# EAGLE design Heatbed-MK24 (EAGLE 6.5.0)
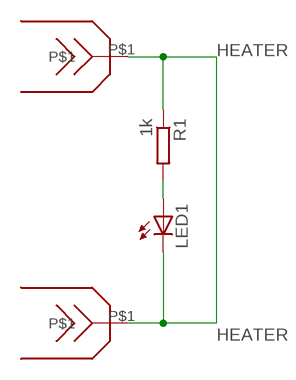
[diagram p0: schematic, sheet 1]

## Parts
LED1  LEDCHIPLED_0805  [CHIPLED_0805]
R1  1k  R-EU_M0805  [M0805]
U$1  FASTONSMD  [FASTONSMD]
U$2  FASTONSMD  [FASTONSMD]

## Nets
HEATER: LED1.C R1.1 U$1.P$1 U$2.P$1
N$1: LED1.A R1.2

## Library data of the parts
LED1 = led:LED: LED OSRAM: - CHIPLED LG R971, LG N971, LY N971, LG Q971, LY Q971, LO R971, LY R971 LH N974, LH R974 LS Q976, LO Q976, LY Q976 LO Q996 - Hyper CHIPLED LW Q18S LB Q993, LB Q99A, LB R99A - SideLED LS A670, LO A670, LY A670, LG A670, LP A670 LB A673, LV A673, LT A673, LW A673 LH A674 LY A675 LS A676, LA A676, LO A676, LY A676, LW A676 LS A679, LY A679, LG A679 - Hyper Micro SIDELED® LS Y876, LA Y876, LO Y876, LY Y876 LT Y87S - SmartLED LW L88C, LW L88S LB L89C, LB L89S, LG L890 LS L89K, LO L89K, LY L89K LS L896, LA L896, LO L896, LY L896 - TOPLED LS T670, LO T670, LY T670, LG T670, LP T670 LSG T670, LSP T670, LSY T670, LOP T670, LYG T670 LG T671, LOG T671, LSG T671 LB T673, LV T673, LT T673, LW T673 LH T674 LS T676, LA T676, LO T676, LY T676, LB T676, LH T676, LSB T676, LW T676 LB T67C, LV T67C, LT T67C, LS T67K, LO T67K, LY T67K, LW E67C LS E67B, LA E67B, LO E67B, LY E67B, LB E67C, LV E67C, LT E67C LW T67C LS T679, LY T679, LG T679 LS T770, LO T770, LY T770, LG T770, LP T770 LB T773, LV T773, LT T773, LW T773 LH T774 LS E675, LA E675, LY E675, LS T675 LS T776, LA T776, LO T776, LY T776, LB T776 LHGB T686 LT T68C, LB T68C - Hyper Mini TOPLED® LB M676 - Mini TOPLED Santana® LG M470 LS M47K, LO M47K, LY M47K Source: http://www.osram.convergy.de LUXEON: - LUMILED® LXK2-PW12-R00, LXK2-PW12-S00, LXK2-PW14-U00, LXK2-PW14-V00 LXK2-PM12-R00, LXK2-PM12-S00, LXK2-PM14-U00 LXK2-PE12-Q00, LXK2-PE12-R00, LXK2-PE12-S00, LXK2-PE14-T00, LXK2-PE14-U00 LXK2-PB12-K00, LXK2-PB12-L00, LXK2-PB12-M00, LXK2-PB14-N00, LXK2-PB14-P00, LXK2-PB14-Q00 LXK2-PR12-L00, LXK2-PR12-M00, LXK2-PR14-Q00, LXK2-PR14-R00 LXK2-PD12-Q00, LXK2-PD12-R00, LXK2-PD12-S00 LXK2-PH12-R00, LXK2-PH12-S00 LXK2-PL12-P00, LXK2-PL12-Q00, LXK2-PL12-R00 Source: www.luxeon.com KINGBRIGHT: KA-3528ASYC Source: www.kingbright.com
R1 = rcl:R-EU_: RESISTOR, European symbol
U$1 U$2 = heatbed:FASTONSMD

## Board
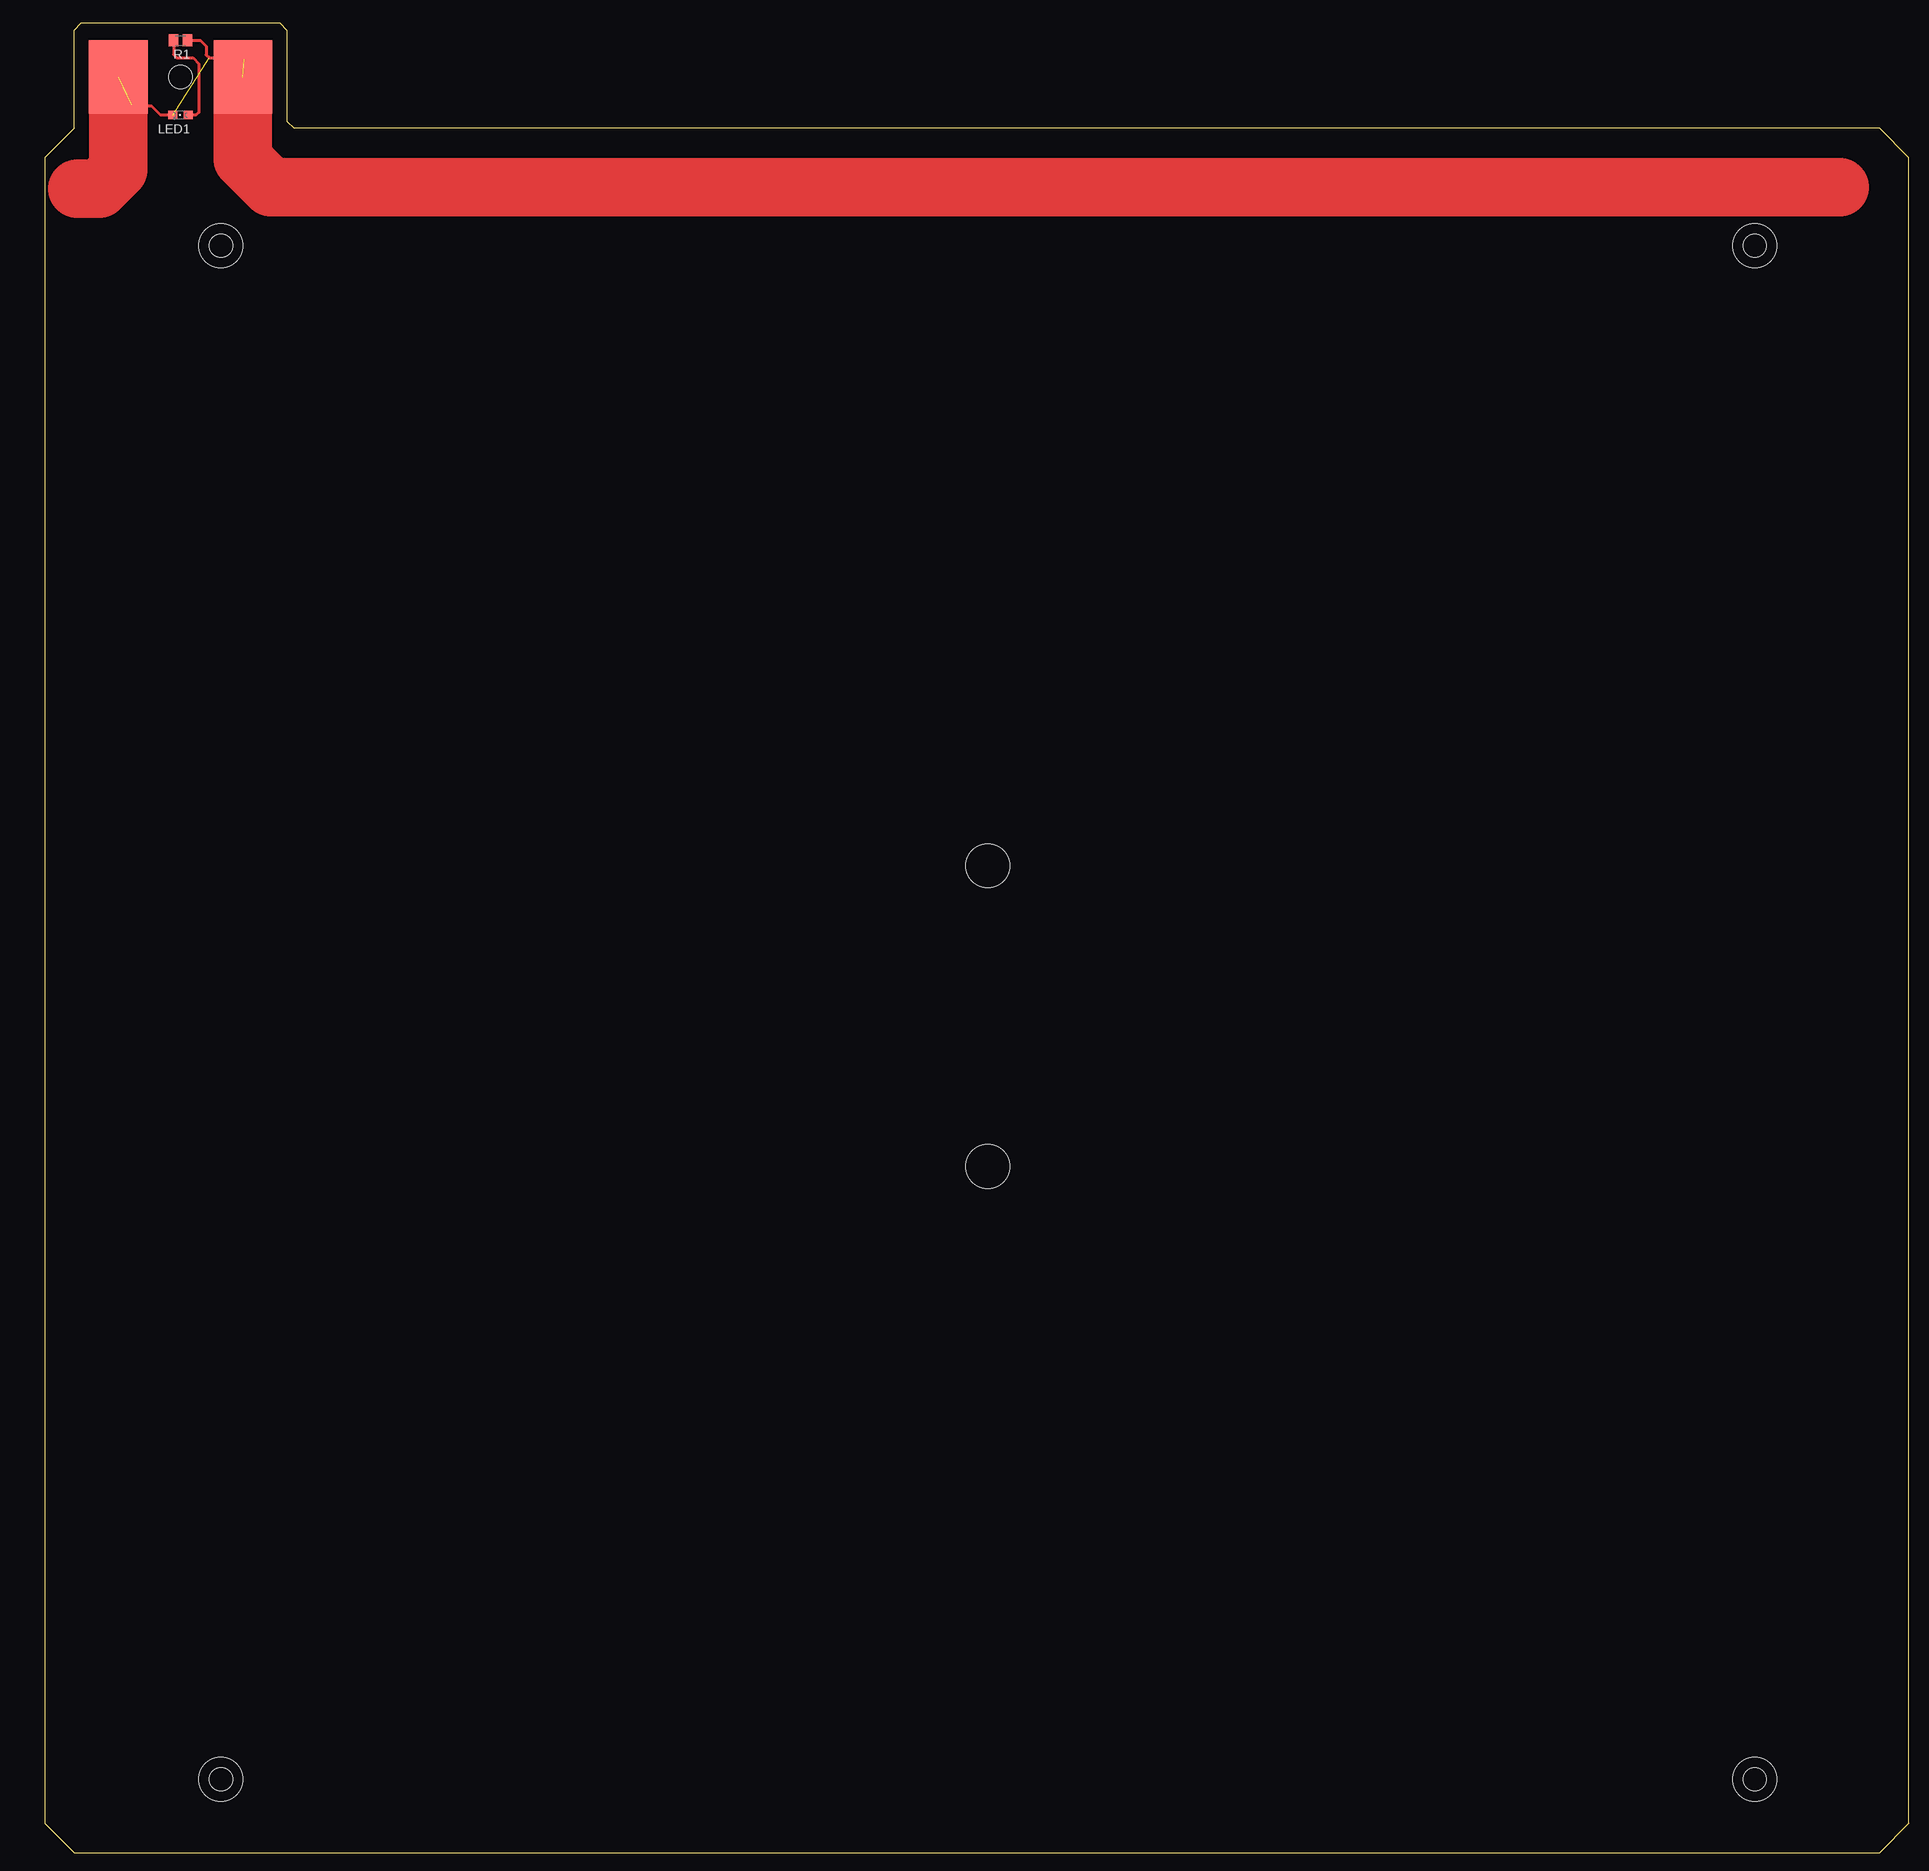
[diagram p1: board, top side]
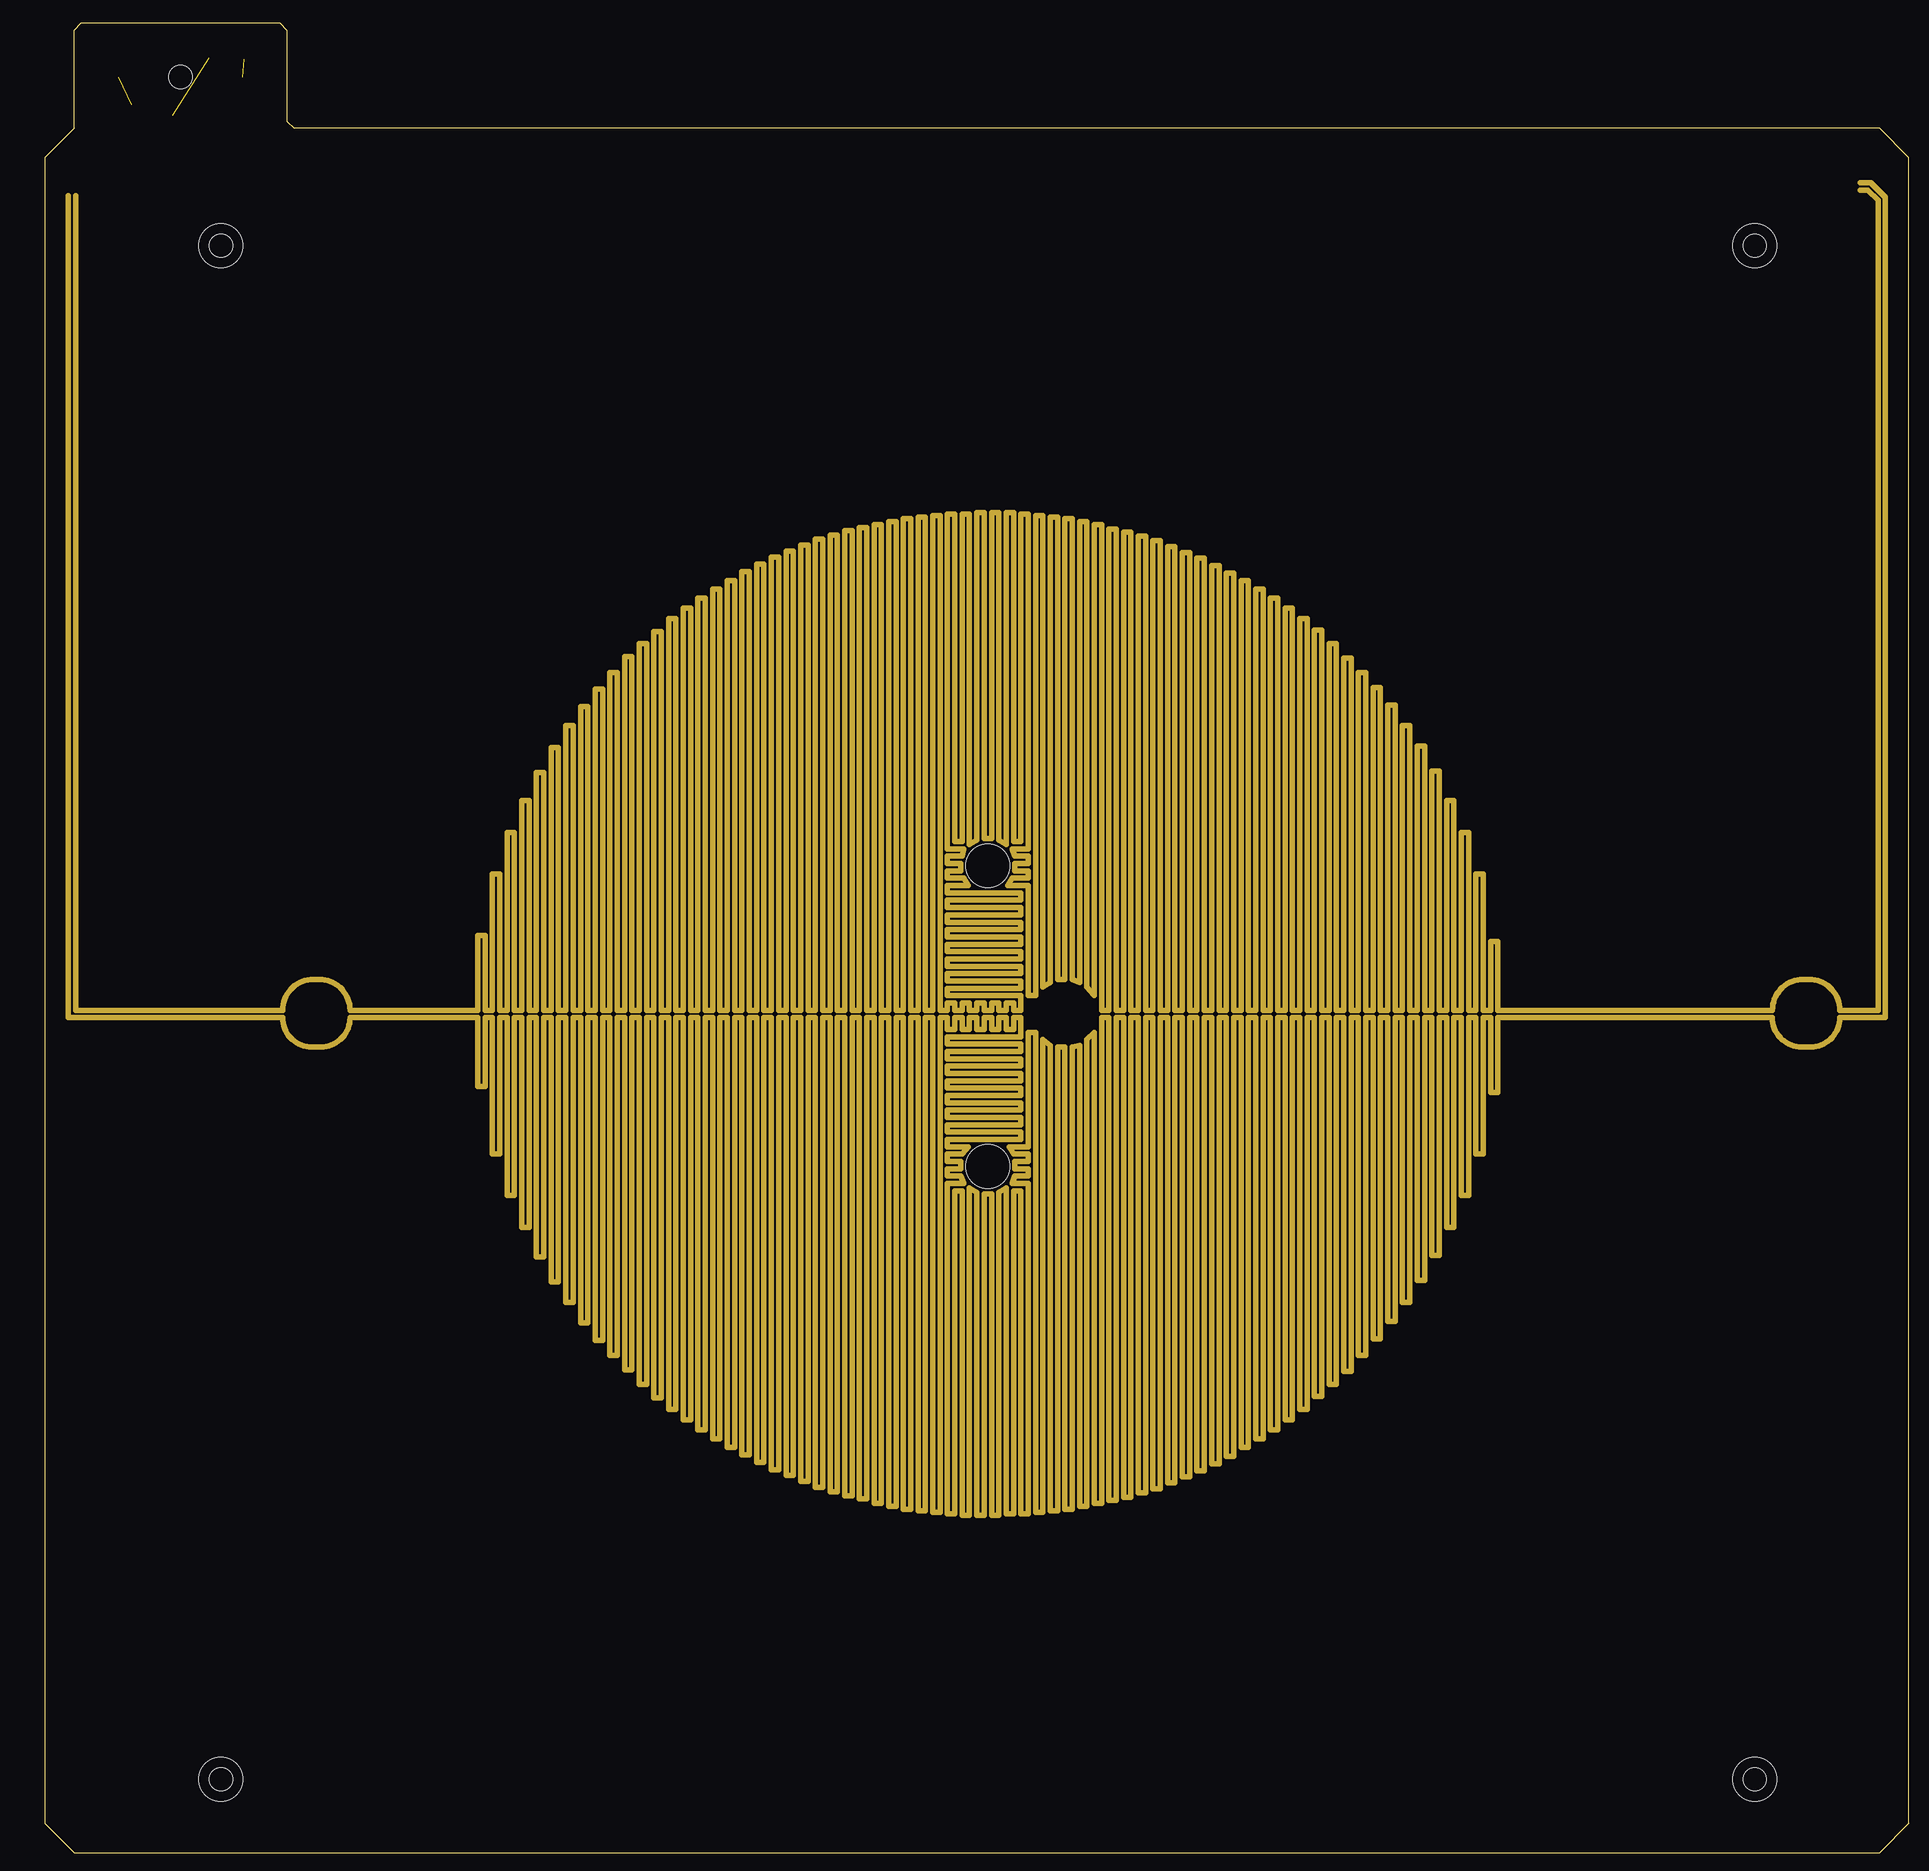
[diagram p2: board, inner layer Top-LowHeat]
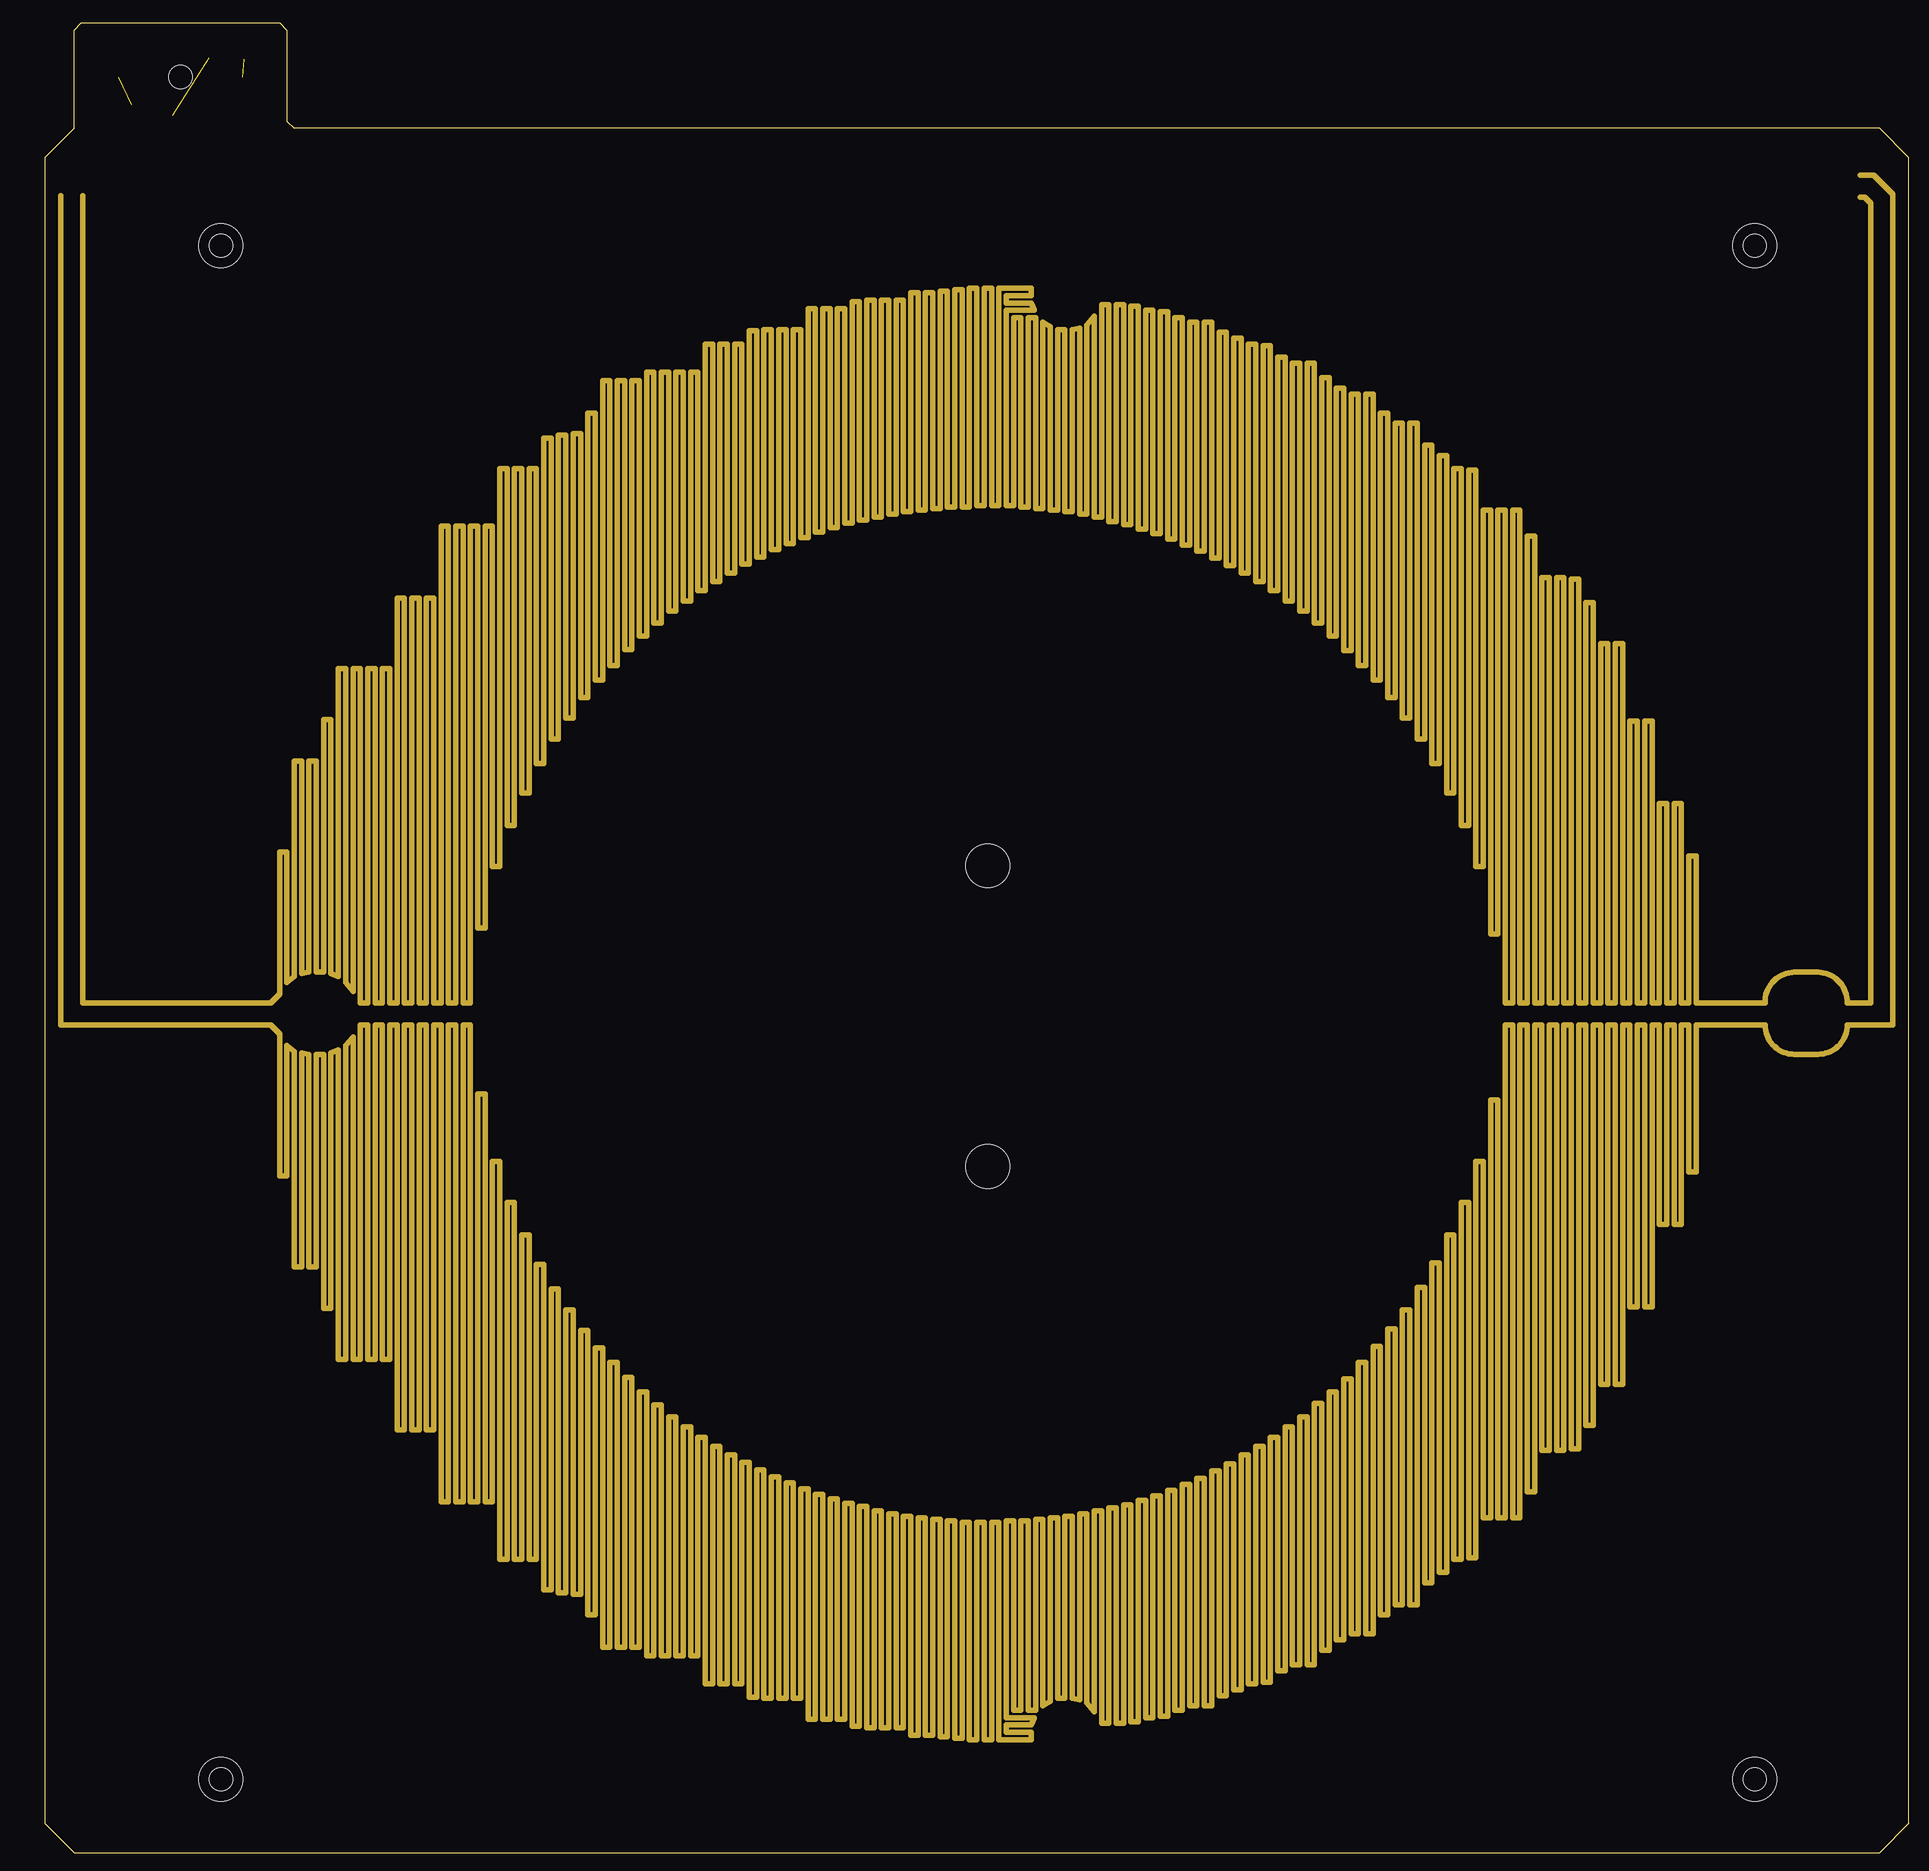
[diagram p3: board, inner layer Top-MedHeat]
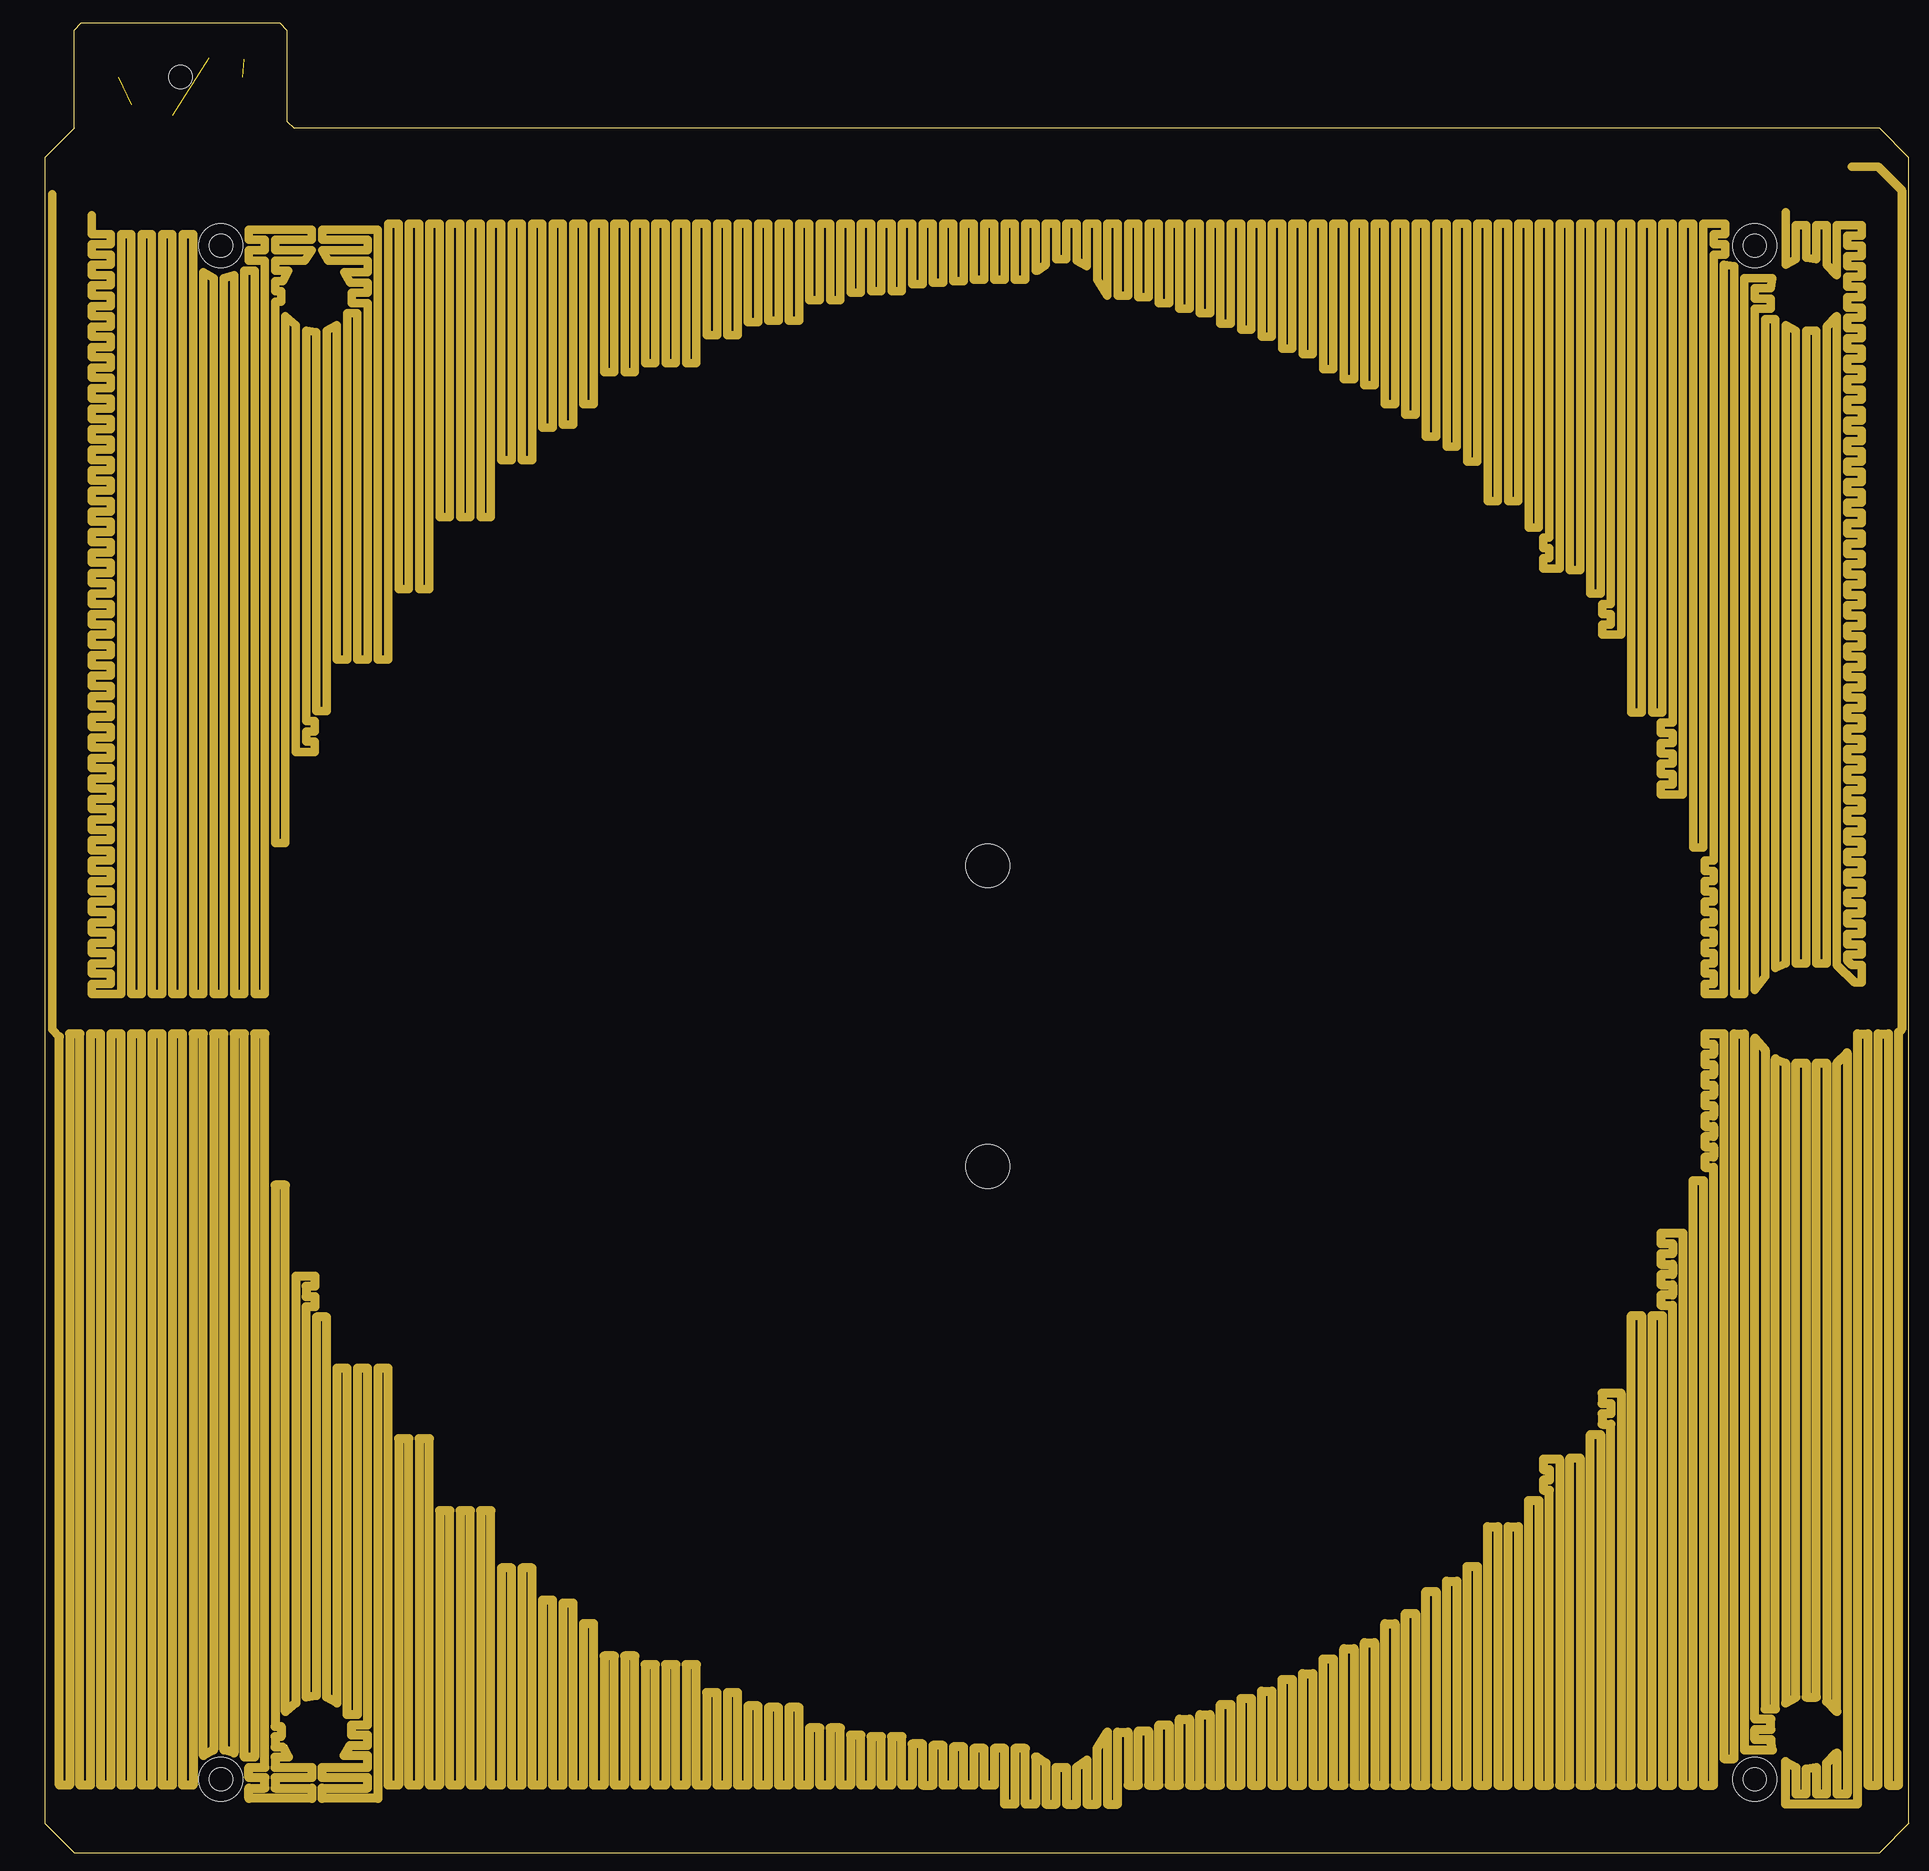
[diagram p4: board, inner layer Top-HighHeat]
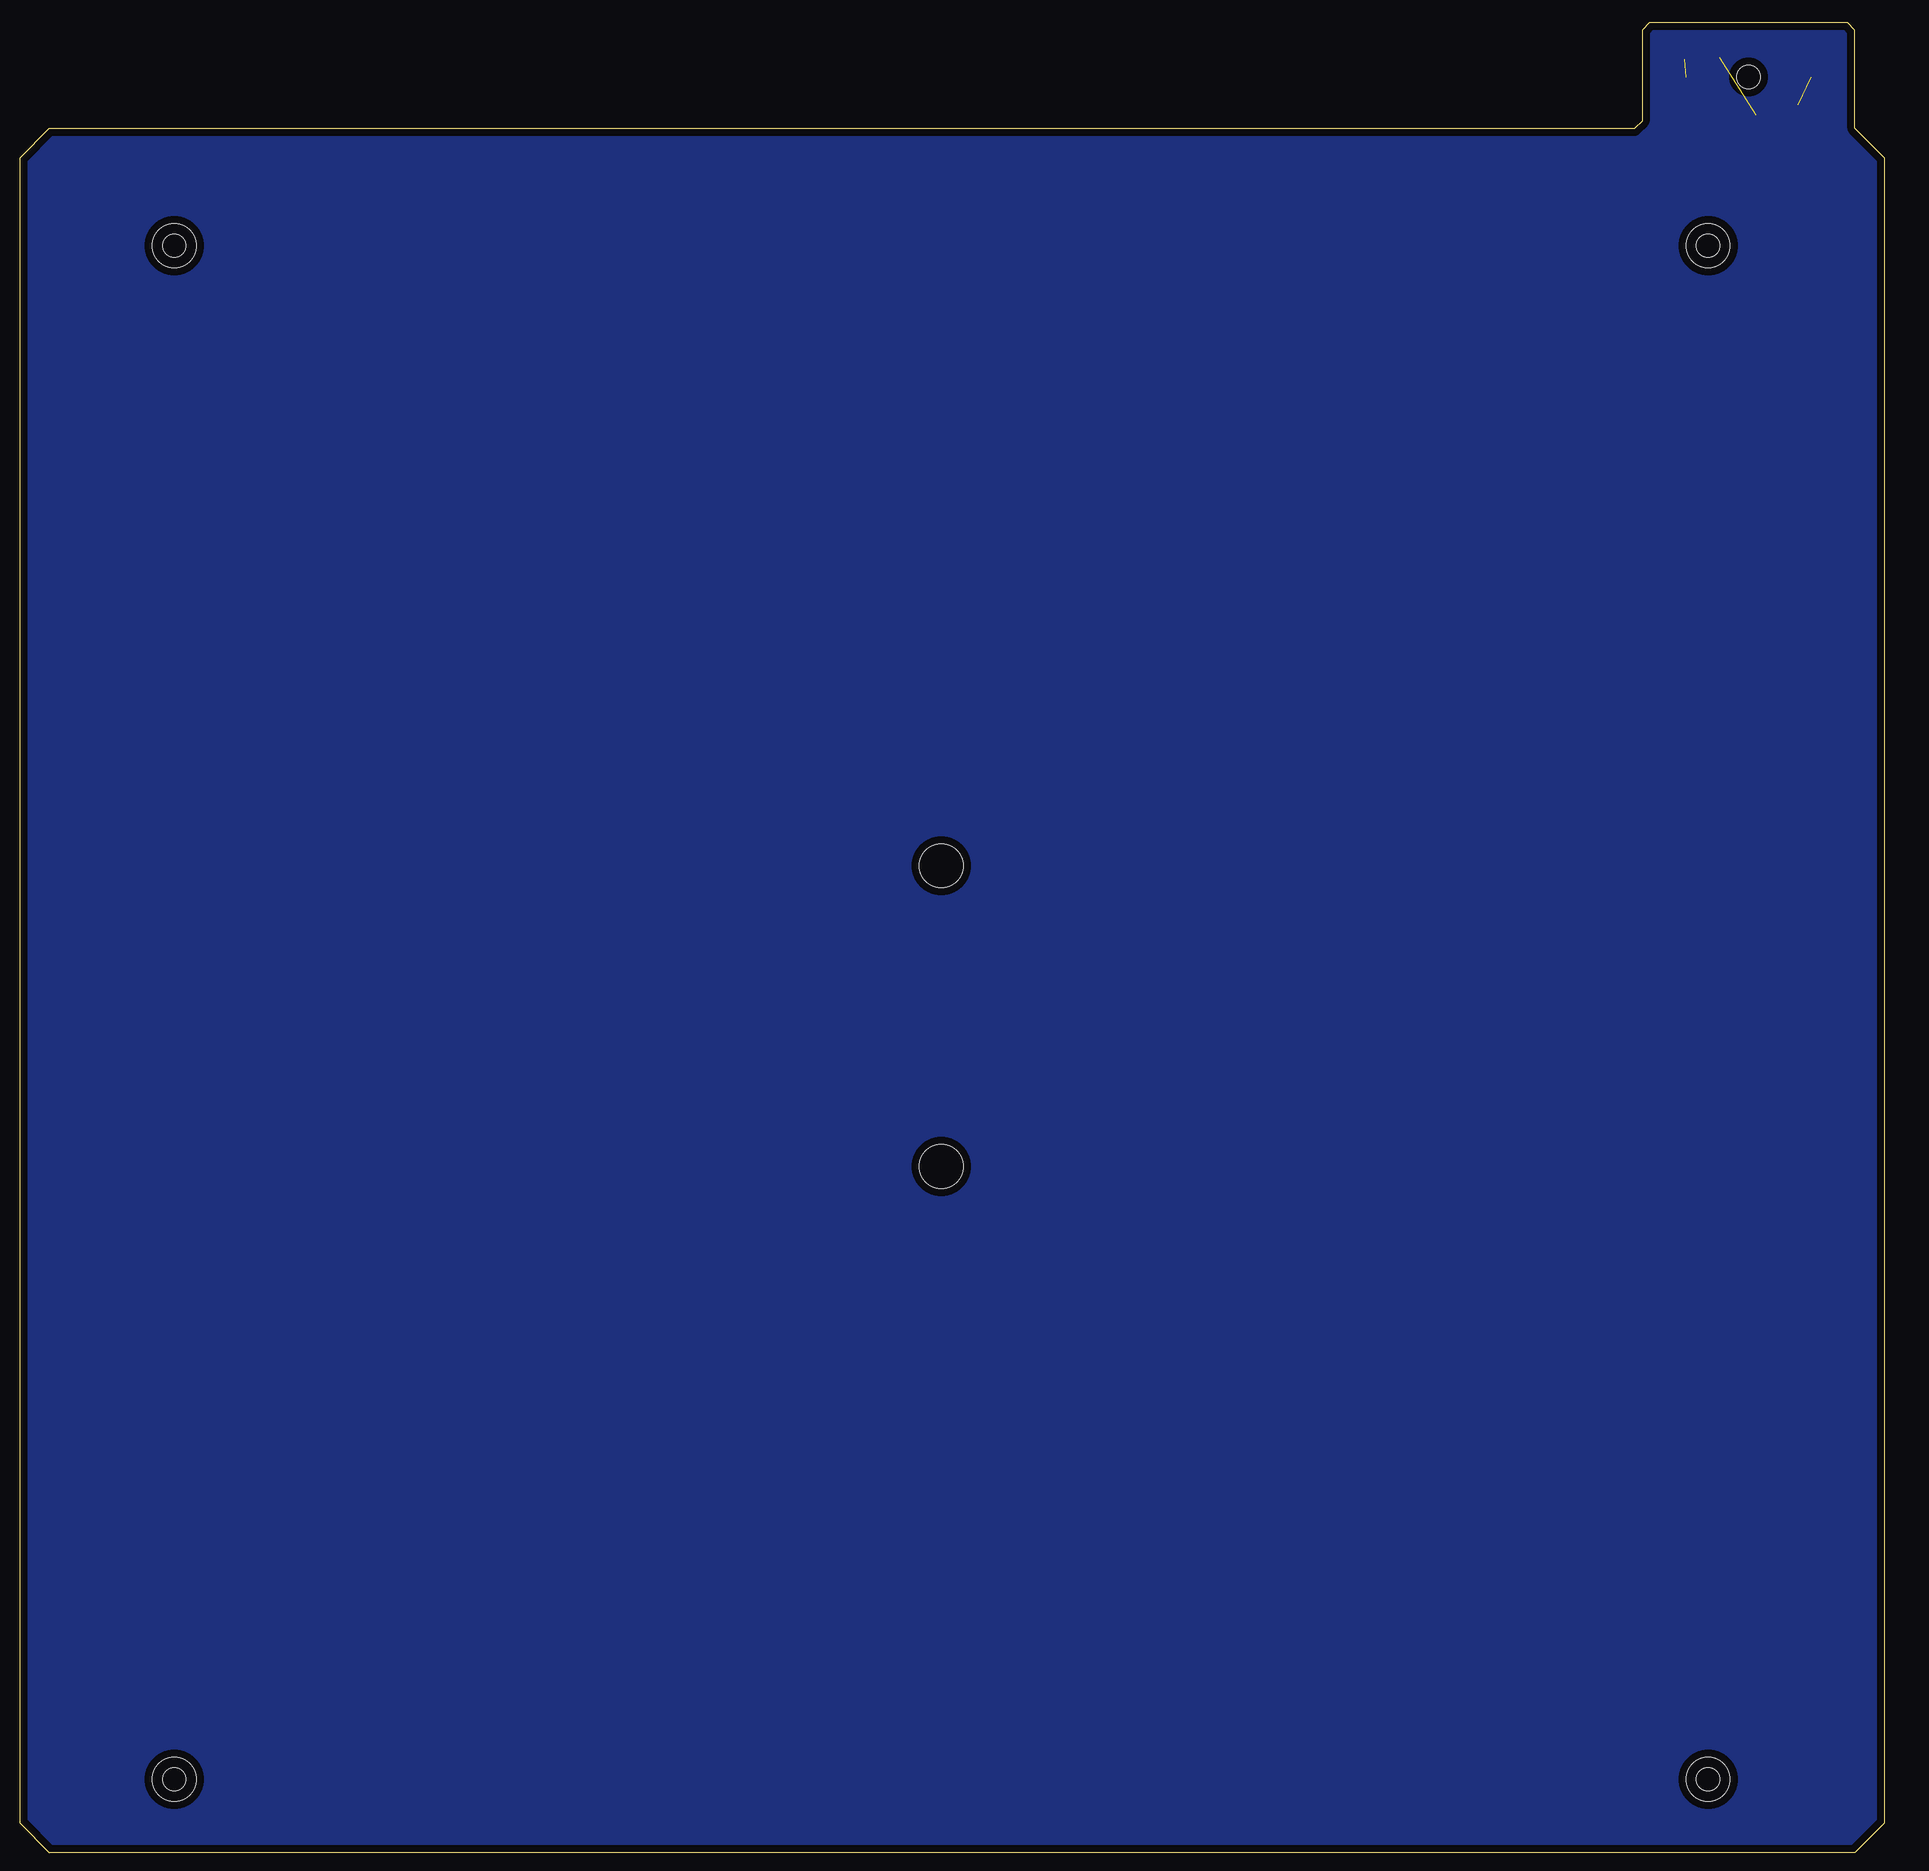
[diagram p5: board, bottom side, seen from below]

Size 254 x 249.4 mm. Coordinates in mm from the lower left corner, seen from the top.
Outline: 250,235 34,235 33,236 33,248.4 32,249.4 5,249.4 4,248.4 4,235 0,231 0,4 4,0 250,0 254,4 254,231 250,235
Copper layers (1+2+3+4+5*16): Top-Supply 0.045mm / dielectric 0.01mm / Top-LowHeat 0.045mm / dielectric 0.01mm / Top-MedHeat 0.045mm / dielectric 0.01mm / Top-HighHeat 0.045mm / dielectric 2.8mm / Leveling 0.045mm / dielectric 0.2mm / Bottom 0.045mm
Design rules "default *": minimum track width 10mil, minimum drill 24mil, track to track 0.15mm, track to pad 0.15mm, pad to pad 0.15mm, via to via 0.15mm, smd to smd 0.15mm, copper to edge 40mil, drill to drill 8mil, minimum pad ring 10mil, minimum via ring 8mil, stop-mask expansion 4mil, vias tented up to drill 0mil, thermal gap 10mil
Holes 3.2 mm at 18.5,242 24,10 233,10 233,219 24,219
Holes 6 mm at 24,10 233,10 233,219 24,219 128.5,93.5 128.5,134.5
tKeepout: area -0.2,112 to 255.8,116.6; area -0.2,112 to 1.8,237; area 252.2,111.4 to 255.6,238.4; area 0.2,5.6 to 252.4,9.4; area 0,219.4 to 252.2,223.2

### Footprints (pad centres in the part's own frame; a part is rotated, then mirrored left to right if it is on the bottom)
CHIPLED_0805 = smd 1.2 x 1.2: A 0,-1.05; C 0,1.05
M0805 = smd 1.3 x 1.6: 1 -0.95,0; 2 0.95,0
FASTONSMD = smd 8 x 10: P$1 0,0

### Placement (x,y rotation side)
LED1  18.5,236.82 90 top
R1  18.5,247 180 top
U$1  10,242 180 top
U$2  27,242 180 top

### Tracks (layer width: path | path; a pad name or v marks a point on that pad's centre or on a via)
HEAT-HIGH-BOT
  Top-HighHeat 1.24: 2,111.2 2,9.2 3.4,9.2 3.4,111.6 4.8,111.6 4.8,9.2 6.2,9.2 6.2,111.6 7.6,111.6 7.6,9.2 9,9.2 9,111.6 10.4,111.6 10.4,9.2 11.8,9.2 11.8,111.6 13.2,111.6 13.2,9.2 14.6,9.2 14.6,111.6 16,111.6 16,9.2 17.4,9.2 17.4,111.6 18.8,111.6 18.8,9.2 20.2,9.2 20.2,111.6 21.6,111.6 21.6,13.2 23,14 23,111.6 24.4,111.6 24.4,14 25.8,13.6 25.8,111.6 27.2,111.6 27.2,13 28.6,13 28.6,111.6 30,111.6 30,11.6 27.8,11.6 27.8,10.2 30,10.2 30,8.8 27.8,8.8 27.8,7.4 36.4,7.4 36.4,8.8 31.4,8.8 31.4,10.2 36.4,10.2 36.4,11.6 31.4,11.6 31.4,13 33.2,13 32.4,14.4 31.4,14.4 31.4,15.8 32.2,15.8 32.2,17.2 31.4,17.2 31.4,91 32.8,91 32.8,19.2 34.2,20.4 34.2,78.6 36.8,78.6 36.8,77.2 35.6,77.2 35.6,75.8 36.8,75.8 36.8,74.4 35.6,74.4 35.6,21.2 37,21.4 37,73 38.4,73 38.4,21.2 39.8,20.4 39.8,66 41.2,66 41.2,18.8 42.6,18.8 42.6,66 44,66 44,17.4 41.8,17.4 41.8,16 44,16 44,14.6 41.6,14.6 40.8,13.2 44,13.2 44,11.6 37.8,11.6 37.8,10.2 44,10.2 44,8.8 37.8,8.8 37.8,7.4 45.4,7.4 45.4,66 46.8,66 46.8,9.2 48.2,9.2 48.2,56.4 49.6,56.4 49.6,9.2 51,9.2 51,56.4 52.4,56.4 52.4,9.2 53.8,9.2 53.8,46.6 55.2,46.6 55.2,9.2 56.6,9.2 56.6,46.6 58,46.6 58,9.2 59.4,9.2 59.4,46.6 60.8,46.6 60.8,9.2 62.2,9.2 62.2,38.8 63.6,38.8 63.6,9.2 65,9.2 65,38.8 66.4,38.8 66.4,9.2 67.8,9.2 67.8,34.4 69.2,34.4 69.2,9.2 70.6,9.2 70.6,34 72,34 72,9.2 73.4,9.2 73.4,31.2 74.8,31.2 74.8,9.2 76.2,9.2 76.2,26.8 77.6,26.8 77.6,9.2 79,9.2 79,26.8 80.4,26.8 80.4,9.2 81.8,9.2 81.8,25.6 83.2,25.6 83.2,9.2 84.6,9.2 84.6,25.6 86,25.6 86,9.2 87.4,9.2 87.4,25.6 88.8,25.6 88.8,9.2 90.2,9.2 90.2,21.8 91.6,21.8 91.6,9.2 93,9.2 93,21.8 94.4,21.8 94.4,9.2 95.8,9.2 95.8,20 97.2,20 97.2,9.2 98.6,9.2 98.6,19.8 100,19.8 100,9.2 101.4,9.2 101.4,19.8 102.8,19.8 102.8,9.2 104.2,9.2 104.2,17 105.6,17 105.6,9.2 107,9.2 107,17 108.4,17 108.4,9.2 109.8,9.2 109.8,16 111.2,16 111.2,9.2 112.6,9.2 112.6,15.8 114,15.8 114,9.2 115.4,9.2 115.4,15.8 116.8,15.8 116.8,9.2 118.2,9.2 118.2,14.8 119.6,14.8 119.6,9.2 121,9.2 121,14.6 122.4,14.6 122.4,9.2 123.8,9.2 123.8,14.4 125.2,14.4 125.2,9.2 126.6,9.2 126.6,14.2 128,14.2 128,9.2 129.4,9.2 129.4,14.2 130.8,14.2 130.8,6.6 132.2,6.6 132.2,14.2 133.6,14.2 133.6,6.6 135,6.6 135,13 135.2,13 136.4,12.2 136.4,6.6 137.8,6.6 137.8,11.6 139.2,11.6 139.2,6.6 140.6,6.6 140.6,11.6 142,12.6 142,6.6 143.4,6.6 143.4,14.2 144.8,16.4 144.8,6.6 146.2,6.6 146.2,16.4 147.6,16.4 147.6,9.2 149,9.2 149,16.6 150.4,16.6 150.4,9.2 151.8,9.2 151.8,17.4 153.2,17.4 153.2,9.2 154.6,9.2 154.6,18.2 156,18.2 156,9.2 157.4,9.2 157.4,18.8 158.8,18.8 158.8,9.2 160.2,9.2 160.2,20.2 161.6,20.2 161.6,9.2 163,9.2 163,21 164.4,21 164.4,9.2 165.8,9.2 165.8,22 167.2,22 167.2,9.2 168.6,9.2 168.6,23.6 170,23.6 170,9.2 171.4,9.2 171.4,24.4 172.8,24.4 172.8,9.2 174.2,9.2 174.2,26.4 175.6,26.4 175.6,9.2 177,9.2 177,27.8 178.4,27.8 178.4,9.2 179.8,9.2 179.8,28.6 181.2,28.6 181.2,9.2 182.6,9.2 182.6,31.2 184,31.2 184,9.2 185.4,9.2 185.4,32.6 186.8,32.6 186.8,9.2 188.2,9.2 188.2,35.6 189.6,35.6 189.6,9.2 191,9.2 191,37 192.4,37 192.4,9.2 193.8,9.2 193.8,39 195.2,39 195.2,9.2 196.6,9.2 196.6,44.4 198,44.4 198,9.2 199.4,9.2 199.4,44.4 200.8,44.4 200.8,9.2 202.2,9.2 202.2,48 203.6,48 203.6,9.2 205,9.2 205,49.4 204.2,49.4 204.2,50.8 205,50.8 205,52.2 204.2,52.2 204.2,53.6 206.4,53.6 206.4,9.2 207.8,9.2 207.8,53.8 209.2,53.8 209.2,9.2 210.6,9.2 210.6,57 212,57 212,9.2 213.4,9.2 213.4,58.4 212.2,58.4 212.2,59.8 213.4,59.8 213.4,61.2 212.2,61.2 212.2,62.6 214.8,62.6 214.8,9.2 216.2,9.2 216.2,73.2 217.6,73.2 217.6,9.2 219,9.2 219,73.2 220.4,73.2 220.4,9.2 221.8,9.2 221.8,74.6 220.2,74.6 220.2,76 221.8,76 221.8,77.4 220.2,77.4 220.2,78.8 221.8,78.8 221.8,80.2 220.2,80.2 220.2,81.6 221.8,81.6 221.8,83 220.2,83 220.2,84.4 223.2,84.4 223.2,9.2 224.6,9.2 224.6,91.6 226,91.6 226,9.2 227.4,9.2 227.4,93.4 226.2,93.4 226.2,94.8 227.4,94.8 227.4,96.2 226.2,96.2 226.2,97.6 227.4,97.6 227.4,99 226.2,99 226.2,100.4 227.4,100.4 227.4,101.8 226.2,101.8 226.2,103.2 227.4,103.2 227.4,104.6 226.2,104.6 226.2,106 227.4,106 227.4,107.4 226.2,107.4 226.2,108.8 227.4,108.8 227.4,110.2 226.2,110.2 226.2,111.6 228.8,111.6 228.8,12.8 230.2,12.8 230.2,111.6 231.6,111.6 231.6,14 235.4,14 235.2,15.4 233,15.4 233,16.8 235.2,16.8 235.2,18.2 233,18.2 233,111 234.4,109.4 234.4,19.6 235.8,19.6 235.8,108.2 237.2,107.6 237.2,20.4 238.6,21.2 238.6,107.6 240,107.6 240,21.2 241.4,21.2 241.4,107.6 242.8,107.6 242.8,20.6 244.2,19.2 244.2,107.6 245.6,109 245.6,8 244.2,8 244.2,13.6 242.8,12.2 242.8,8 241.4,8 241.4,11.6 240,11.4 240,8 238.6,8 238.6,11.6 237.2,12.4 237.2,6.6 247,6.6 247,111.6 248.4,111.6 248.4,9.2 249.8,9.2 249.8,111.6 251.2,111.6 251.2,9.2 252.6,9.2 252.6,111.8
HEAT-HIGH-TOP
  Top-HighHeat 1.15: 237.2,223.6 237.2,216.4 238.6,217.2 238.6,221.8 240,221.8 240,217.4 241.4,217.2 241.4,221.8 242.8,221.8 242.8,216.4 244.2,215 244.2,221.8 247.6,221.8 247.6,220.4 245.6,220.4 245.6,219 247.6,219 247.6,217.6 245.6,217.6 245.6,216.2 247.6,216.2 247.6,214.8 245.6,214.8 245.6,213.4 247.6,213.4 247.6,212 245.6,212 245.6,210.6 247.6,210.6 247.6,209.2 245.6,209.2 245.6,207.8 247.6,207.8 247.6,206.4 245.6,206.4 245.6,205 247.6,205 247.6,203.6 245.6,203.6 245.6,202.2 247.6,202.2 247.6,200.8 245.6,200.8 245.6,199.4 247.6,199.4 247.6,198 245.6,198 245.6,196.6 247.6,196.6 247.6,195.2 245.6,195.2 245.6,193.8 247.6,193.8 247.6,192.4 245.6,192.4 245.6,191 247.6,191 247.6,189.6 245.6,189.6 245.6,188.2 247.6,188.2 247.6,186.8 245.6,186.8 245.6,185.4 247.6,185.4 247.6,184 245.6,184 245.6,182.6 247.6,182.6 247.6,181.2 245.6,181.2 245.6,179.8 247.6,179.8 247.6,178.4 245.6,178.4 245.6,177 247.6,177 247.6,175.6 245.6,175.6 245.6,174.2 247.6,174.2 247.6,172.8 245.6,172.8 245.6,171.4 247.6,171.4 247.6,170 245.6,170 245.6,168.6 247.6,168.6 247.6,167.2 245.6,167.2 245.6,165.8 247.6,165.8 247.6,164.4 245.6,164.4 245.6,163 247.6,163 247.6,161.6 245.6,161.6 245.6,160.2 247.6,160.2 247.6,158.8 245.6,158.8 245.6,157.4 247.6,157.4 247.6,156 245.6,156 245.6,154.6 247.6,154.6 247.6,153.2 245.6,153.2 245.6,151.8 247.6,151.8 247.6,150.4 245.6,150.4 245.6,149 247.6,149 247.6,147.6 245.6,147.6 245.6,146.2 247.6,146.2 247.6,144.8 245.6,144.8 245.6,143.4 247.6,143.4 247.6,142 245.6,142 245.6,140.6 247.6,140.6 247.6,139.2 245.6,139.2 245.6,137.8 247.6,137.8 247.6,136.4 245.6,136.4 245.6,135 247.6,135 247.6,133.6 245.6,133.6 245.6,132.2 247.6,132.2 247.6,130.8 245.6,130.8 245.6,129.4 247.6,129.4 247.6,128 245.6,128 245.6,126.6 247.6,126.6 247.6,125.2 245.6,125.2 245.6,123.8 247.6,123.8 247.6,122.4 245.6,122.4 245.6,121.6 246.2,121 247.6,121 247.6,118.6 246.6,118.6 244.2,121 244.2,209.4 242.8,208 242.8,121.2 241.4,121.2 241.4,207.4 240,207.4 240,121.2 238.6,121.2 238.6,207.4 237.2,208.2 237.2,121.2 235.8,120.6 235.8,209 234.4,209 234.4,119.4 233,117.6 233,210.4 235.2,210.4 235.2,211.8 233,211.8 233,213.2 235.2,213.2 235.4,214.6 231.6,214.6 231.6,117 230.2,117 230.2,216.2 228.8,216.4 228.8,117 226.2,117 226.2,118.4 227.4,118.4 227.4,119.8 226.2,119.8 226.2,121.2 227.4,121.2 227.4,122.6 226.2,122.6 226.2,124 227.4,124 227.4,125.4 226.2,125.4 226.2,126.8 227.4,126.8 227.4,128.2 226.2,128.2 226.2,129.6 227.4,129.6 227.4,131 226.2,131 226.2,132.4 227.4,132.4 227.4,133.8 226.2,133.8 226.2,135.2 227.4,135.2 227.4,217.8 229,217.8 229,219.2 227.4,219.2 227.4,220.6 229,220.6 229,222 226,222 226,137 224.6,137 224.6,222 223.2,222 223.2,144.2 220.2,144.2 220.2,145.6 221.8,145.6 221.8,147 220.2,147 220.2,148.4 221.8,148.4 221.8,149.8 220.2,149.8 220.2,151.2 221.8,151.2 221.8,152.6 220.2,152.6 220.2,154 221.8,154 221.8,222 220.4,222 220.4,155.4 219,155.4 219,222 217.6,222 217.6,155.4 216.2,155.4 216.2,222 214.8,222 214.8,166 212.2,166 212.2,167.4 213.4,167.4 213.4,168.8 212.2,168.8 212.2,170.2 213.4,170.2 213.4,222 212,222 212,171.6 210.6,171.6 210.6,222 209.2,222 209.2,174.8 207.8,174.8 207.8,222 206.4,222 206.4,175 204.2,175 204.2,176.4 205,176.4 205,177.8 204.2,177.8 204.2,179.2 205,179.2 205,222 203.6,222 203.6,180.6 202.2,180.6 202.2,222 200.8,222 200.8,184.2 199.4,184.2 199.4,222 198,222 198,184.2 196.6,184.2 196.6,222 195.2,222 195.2,189.6 193.8,189.6 193.8,222 192.4,222 192.4,191.6 191,191.6 191,222 189.6,222 189.6,193 188.2,193 188.2,222 186.8,222 186.8,196 185.4,196 185.4,222 184,222 184,197.4 182.6,197.4 182.6,222 181.2,222 181.2,200 179.8,200 179.8,222 178.4,222 178.4,200.8 177,200.8 177,222 175.6,222 175.6,202.2 174.2,202.2 174.2,222 172.8,222 172.8,204.2 171.4,204.2 171.4,222 170,222 170,205 168.6,205 168.6,222 167.2,222 167.2,206.6 165.8,206.6 165.8,222 164.4,222 164.4,207.6 163,207.6 163,222 161.6,222 161.6,208.4 160.2,208.4 160.2,222 158.8,222 158.8,209.8 157.4,209.8 157.4,222 156,222 156,210.4 154.6,210.4 154.6,222 153.2,222 153.2,211.2 151.8,211.2 151.8,222 150.4,222 150.4,212 149,212 149,222 147.6,222 147.6,212.2 146.2,212.2 146.2,222 144.8,222 144.8,212.2 143.4,214.4 143.4,222 142,222 142,216.2 140.6,217 140.6,222 139.2,222 139.2,217.2 137.8,217.2 137.8,222 136.4,222 136.4,216.4 135.2,215.6 135,215.6 135,222 133.6,222 133.6,214.4 132.2,214.4 132.2,222 130.8,222 130.8,214.4 129.4,214.4 129.4,222 128,222 128,214.4 126.6,214.4 126.6,222 125.2,222 125.2,214.2 123.8,214.2 123.8,222 122.4,222 122.4,214 121,214 121,222 119.6,222 119.6,213.8 118.2,213.8 118.2,222 116.8,222 116.8,212.8 115.4,212.8 115.4,222 114,222 114,212.8 112.6,212.8 112.6,222 111.2,222 111.2,212.6 109.8,212.6 109.8,222 108.4,222 108.4,211.6 107,211.6 107,222 105.6,222 105.6,211.6 104.2,211.6 104.2,222 102.8,222 102.8,208.8 101.4,208.8 101.4,222 100,222 100,208.8 98.6,208.8 98.6,222 97.2,222 97.2,208.6 95.8,208.6 95.8,222 94.4,222 94.4,206.8 93,206.8 93,222 91.6,222 91.6,206.8 90.2,206.8 90.2,222 88.8,222 88.8,203 87.4,203 87.4,222 86,222 86,203 84.6,203 84.6,222 83.2,222 83.2,203 81.8,203 81.8,222 80.4,222 80.4,201.8 79,201.8 79,222 77.6,222 77.6,201.8 76.2,201.8 76.2,222 74.8,222 74.8,197.4 73.4,197.4 73.4,222 72,222 72,194.6 70.6,194.6 70.6,222 69.2,222 69.2,194.2 67.8,194.2 67.8,222 66.4,222 66.4,189.8 65,189.8 65,222 63.6,222 63.6,189.8 62.2,189.8 62.2,222 60.8,222 60.8,182 59.4,182 59.4,222 58,222 58,182 56.6,182 56.6,222 55.2,222 55.2,182 53.8,182 53.8,222 52.4,222 52.4,172.2 51,172.2 51,222 49.6,222 49.6,172.2 48.2,172.2 48.2,222 46.8,222 46.8,162.6 45.4,162.6 45.4,221.2 37.8,221.2 37.8,219.8 44,219.8 44,218.4 37.8,218.4 38.6,217 44,217 44,215.4 40.8,215.4 41.6,214 44,214 44,212.6 41.8,212.6 41.8,211.2 44,211.2 44,162.6 42.6,162.6 42.6,209.8 41.2,209.8 41.2,162.6 39.8,162.6 39.8,208.2 38.4,207.4 38.4,155.6 37,155.6 37,207.2 35.6,207.4 35.6,154.2 36.8,154.2 36.8,152.8 35.6,152.8 35.6,151.4 36.8,151.4 36.8,150 34.2,150 34.2,208.2 32.8,209.4 32.8,137.6 31.4,137.6 31.4,211.4 32.2,211.4 32.2,212.8 31.4,212.8 31.4,214.2 32.4,214.2 33.2,215.6 31.4,215.6 31.4,217 35.4,217 36.4,218.4 31.4,218.4 31.4,219.8 36.4,219.8 36.4,221.2 27.8,221.2 27.8,219.8 30,219.8 30,218.4 27.8,218.4 27.8,217 30,217 30,117 28.6,117 28.6,215.6 27.2,215.6 27.2,117 25.8,117 25.8,215 24.4,214.6 24.4,117 23,117 23,214.6 21.6,215.4 21.6,117 20.2,117 20.2,220.6 18.8,220.6 18.8,117 17.4,117 17.4,220.6 16,220.6 16,117 14.6,117 14.6,220.6 13.2,220.6 13.2,117 11.8,117 11.8,220.6 10.4,220.6 10.4,117 6.4,117 6.4,118.4 9,118.4 9,119.8 6.4,119.8 6.4,121.2 9,121.2 9,122.6 6.4,122.6 6.4,124 9,124 9,125.4 6.4,125.4 6.4,126.8 9,126.8 9,128.2 6.4,128.2 6.4,129.6 9,129.6 9,131 6.4,131 6.4,132.4 9,132.4 9,133.8 6.4,133.8 6.4,135.2 9,135.2 9,136.6 6.4,136.6 6.4,138 9,138 9,139.4 6.4,139.4 6.4,140.8 9,140.8 9,142.2 6.4,142.2 6.4,143.6 9,143.6 9,145 6.4,145 6.4,146.4 9,146.4 9,147.8 6.4,147.8 6.4,149.2 9,149.2 9,150.6 6.4,150.6 6.4,152 9,152 9,153.4 6.4,153.4 6.4,154.8 9,154.8 9,156.2 6.4,156.2 6.4,157.6 9,157.6 9,159 6.4,159 6.4,160.4 9,160.4 9,161.8 6.4,161.8 6.4,163.2 9,163.2 9,164.6 6.4,164.6 6.4,166 9,166 9,167.4 6.4,167.4 6.4,168.8 9,168.8 9,170.2 6.4,170.2 6.4,171.6 9,171.6 9,173 6.4,173 6.4,174.4 9,174.4 9,175.8 6.4,175.8 6.4,177.2 9,177.2 9,178.6 6.4,178.6 6.4,180 9,180 9,181.4 6.4,181.4 6.4,182.8 9,182.8 9,184.2 6.4,184.2 6.4,185.6 9,185.6 9,187 6.4,187 6.4,188.4 9,188.4 9,189.8 6.4,189.8 6.4,191.2 9,191.2 9,192.6 6.4,192.6 6.4,194 9,194 9,195.4 6.4,195.4 6.4,196.8 9,196.8 9,198.2 6.4,198.2 6.4,199.6 9,199.6 9,201 6.4,201 6.4,202.4 9,202.4 9,203.8 6.4,203.8 6.4,205.2 9,205.2 9,206.6 6.4,206.6 6.4,208 9,208 9,209.4 6.4,209.4 6.4,210.8 9,210.8 9,212.2 6.4,212.2 6.4,213.6 9,213.6 9,215 6.4,215 6.4,216.4 9,216.4 9,217.8 6.4,217.8 6.4,219.2 9,219.2 9,220.6 6.4,220.6 6.4,223.2
HEAT-MED-BOT
  Top-MedHeat 0.751: 2.2,225.8 2.2,112.8 30.8,112.8 32,111.6 32,92.2 33,92.2 33,110 34,109.2 34,79.8 35,79.8 35,109 36,108.8 36,79.8 37,79.8 37,108.8 38,108.8 38,74.2 39,74.2 39,109 40,109.4 40,67.2 41,67.2 41,110 42,111.2 42,67.2 43,67.2 43,112.8 44,112.8 44,67.2 45,67.2 45,112.8 46,112.8 46,67.2 47,67.2 47,112.8 48,112.8 48,57.6 49,57.6 49,112.8 50,112.8 50,57.6 51,57.6 51,112.8 52,112.8 52,57.6 53,57.6 53,112.8 54,112.8 54,47.8 55,47.8 55,112.8 56,112.8 56,47.8 57,47.8 57,112.8 58,112.8 58,47.8 59,47.8 59,103.4 60,103.4 60,47.8 61,47.8 61,94.2 62,94.2 62,40 63,40 63,88.6 64,88.6 64,40 65,40 65,84.2 66,84.2 66,40 67,40 67,80.2 68,80.2 68,35.8 69,35.8 69,76.8 70,76.8 70,35.4 71,35.4 71,74 72,74 72,35.2 73,35.2 73,71.2 74,71.2 74,32.4 75,32.4 75,68.8 76,68.8 76,28 77,28 77,66.8 78,66.8 78,28 79,28 79,64.8 80,64.8 80,28 81,28 81,62.8 82,62.8 82,26.8 83,26.8 83,61 84,61 84,26.8 85,26.8 85,59.4 86,59.4 86,26.8 87,26.8 87,58 88,58 88,26.8 89,26.8 89,56.6 90,56.6 90,23 91,23 91,55.4 92,55.4 92,23 93,23 93,54.2 94,54.2 94,23 95,23 95,53.2 96,53.2 96,21.2 97,21.2 97,52.2 98,52.2 98,21 99,21 99,51.2 100,51.2 100,21 101,21 101,50.4 102,50.4 102,21 103,21 103,49.6 104,49.6 104,18.2 105,18.2 105,48.8 106,48.8 106,18.2 107,18.2 107,48.2 108,48.2 108,18.2 109,18.2 109,47.6 110,47.6 110,17.2 111,17.2 111,47.2 112,47.2 112,17 113,17 113,46.6 114,46.6 114,17 115,17 115,46.2 116,46.2 116,17 117,17 117,45.8 118,45.8 118,16 119,16 119,45.6 120,45.6 120,16 121,16 121,45.4 122,45.4 122,15.8 123,15.8 123,45.2 124,45.2 124,15.6 125,15.6 125,45 126,45 126,15.4 127,15.4 127,45 128,45 128,15.4 129,15.4 129,45 130,45 130,15.4 134.4,15.4 134.4,16.4 131,16.4 131,17.4 134.4,17.4 134.8,18.4 131,18.4 131,18.8 131,45.2 132,45.2 132,19.4 133,19.4 133,45.2 134,45.2 134,19.4 135,19.4 135,45.4 136,45.4 136,20 137,20.6 137,45.6 138,45.6 138,21 139,21 139,45.8 140,45.8 140,21 141,20.8 141,46.2 142,46.2 142,20.4 143,19.2 143,46.6 144,46.6 144,17.6 145,17.6 145,47 146,47 146,17.6 147,17.6 147,47.4 148,47.4 148,17.8 149,17.8 149,48 150,48 150,18.4 151,18.4 151,48.6 152,48.6 152,18.6 153,18.6 153,49.4 154,49.4 154,19.4 155,19.4 155,50.2 156,50.2 156,20 157,20 157,51 158,51 158,20 159,20 159,52 160,52 160,21.4 161,21.4 161,53 162,53 162,22.2 163,22.2 163,54.2 164,54.2 164,23 165,23 165,55.4 166,55.4 166,23.2 167,23.2 167,56.6 168,56.6 168,24.8 169,24.8 169,58 170,58 170,25.6 171,25.6 171,59.4 172,59.4 172,25.6 173,25.6 173,61.2 174,61.2 174,27.6 175,27.6 175,62.8 176,62.8 176,29 177,29 177,64.6 178,64.6 178,29.8 179,29.8 179,66.8 180,66.8 180,29.8 181,29.8 181,69 182,69 182,32.4 183,32.4 183,71.4 184,71.4 184,33.8 185,33.8 185,74 186,74 186,33.8 187,33.8 187,77 188,77 188,36.8 189,36.8 189,80.4 190,80.4 190,38.2 191,38.2 191,84.2 192,84.2 192,40 193,40 193,88.6 194,88.6 194,40.2 195,40.2 195,94.2 196,94.2 196,45.6 197,45.6 197,102.6 198,102.6 198,45.6 199,45.6 199,112.8 200,112.8 200,45.6 201,45.6 201,112.8 202,112.8 202,49.2 203,49.2 203,112.8 204,112.8 204,54.8 205,54.8 205,112.8 206,112.8 206,54.8 207,54.8 207,112.8 208,112.8 208,55 209,55 209,112.8 210,112.8 210,58.2 211,58.2 211,112.8 212,112.8 212,63.8 213,63.8 213,112.8 214,112.8 214,63.8 215,63.8 215,112.8 216,112.8 216,74.4 217,74.4 217,112.8 218,112.8 218,74.4 219,74.4 219,112.8 220,112.8 220,85.6 221,85.6 221,112.8 222,112.8 222,85.6 223,85.6 223,112.8 224,112.8 224,92.8 225,92.8 225,112.8 234.4,112.8 arc90 238.4,108.8 241.6,108.8 arc90 245.6,112.8 251.8,112.8 251.8,226 249.2,228.6 247.4,228.6
HEAT-MED-TOP
  Top-MedHeat 0.751: 5.2,225.8 5.2,115.8 30.8,115.8 32,117 32,136.4 33,136.4 33,118.6 34,119.4 34,148.8 35,148.8 35,119.8 36,120 36,148.8 37,148.8 37,120 38,120 38,154.4 39,154.4 39,119.8 40,119.4 40,161.4 41,161.4 41,118.6 42,117.4 42,161.4 43,161.4 43,115.8 44,115.8 44,161.4 45,161.4 45,115.8 46,115.8 46,161.4 47,161.4 47,115.8 48,115.8 48,171 49,171 49,115.8 50,115.8 50,171 51,171 51,115.8 52,115.8 52,171 53,171 53,115.8 54,115.8 54,180.8 55,180.8 55,115.8 56,115.8 56,180.8 57,180.8 57,115.8 58,115.8 58,180.8 59,180.8 59,126 60,126 60,180.8 61,180.8 61,134.4 62,134.4 62,188.6 63,188.6 63,140 64,140 64,188.6 65,188.6 65,144.4 66,144.4 66,188.6 67,188.6 67,148.4 68,148.4 68,192.8 69,192.8 69,151.8 70,151.8 70,193.2 71,193.2 71,154.6 72,154.6 72,193.4 73,193.4 73,157.4 74,157.4 74,196.2 75,196.2 75,159.8 76,159.8 76,200.6 77,200.6 77,161.8 78,161.8 78,200.6 79,200.6 79,164 80,164 80,200.6 81,200.6 81,165.8 82,165.8 82,201.8 83,201.8 83,167.6 84,167.6 84,201.8 85,201.8 85,169.2 86,169.2 86,201.8 87,201.8 87,170.6 88,170.6 88,201.8 89,201.8 89,172 90,172 90,205.6 91,205.6 91,173.2 92,173.2 92,205.6 93,205.6 93,174.4 94,174.4 94,205.6 95,205.6 95,175.6 96,175.6 96,207.4 97,207.4 97,176.6 98,176.6 98,207.6 99,207.6 99,177.6 100,177.6 100,207.6 101,207.6 101,178.4 102,178.4 102,207.6 103,207.6 103,179.2 104,179.2 104,210.4 105,210.4 105,180 106,180 106,210.4 107,210.4 107,180.6 108,180.6 108,210.4 109,210.4 109,181.2 110,181.2 110,211.4 111,211.4 111,181.6 112,181.6 112,211.6 113,211.6 113,182 114,182 114,211.6 115,211.6 115,182.4 116,182.4 116,211.6 117,211.6 117,182.8 118,182.8 118,212.6 119,212.6 119,183 120,183 120,212.6 121,212.6 121,183.2 122,183.2 122,212.8 123,212.8 123,183.4 124,183.4 124,213 125,213 125,183.4 126,183.4 126,213.2 127,213.2 127,183.6 128,183.6 128,213.2 129,213.2 129,183.6 130,183.6 130,213.2 134.4,213.2 134.4,212.2 131,212.2 131,211.2 134.4,211.2 134.8,210.2 131,210.2 131,183.6 132,183.6 132,209.2 133,209.2 133,183.4 134,183.4 134,209.2 135,209.2 135,183.2 136,183.2 136,208.6 137,208 137,183 138,183 138,207.6 139,207.6 139,182.8 140,182.8 140,207.6 141,207.8 141,182.4 142,182.4 142,208.2 143,209.4 143,182 144,182 144,211 145,211 145,181.4 146,181.4 146,211 147,211 147,181 148,181 148,210.8 149,210.8 149,180.4 150,180.4 150,210.2 151,210.2 151,179.8 152,179.8 152,210 153,210 153,179 154,179 154,209.2 155,209.2 155,178.2 156,178.2 156,208.6 157,208.6 157,177.4 158,177.4 158,208.6 159,208.6 159,176.4 160,176.4 160,207.2 161,207.2 161,175.4 162,175.4 162,206.4 163,206.4 163,174.4 164,174.4 164,205.6 165,205.6 165,173.2 166,173.2 166,205.4 167,205.4 167,172 168,172 168,203.8 169,203.8 169,170.6 170,170.6 170,203 171,203 171,169.2 172,169.2 172,203 173,203 173,167.6 174,167.6 174,201 175,201 175,165.8 176,165.8 176,199.6 177,199.6 177,163.8 178,163.8 178,198.8 179,198.8 179,161.8 180,161.8 180,198.8 181,198.8 181,159.8 182,159.8 182,196.2 183,196.2 183,157.4 184,157.4 184,194.8 185,194.8 185,154.6 186,154.6 186,194.8 187,194.8 187,151.8 188,151.8 188,191.8 189,191.8 189,148.4 190,148.4 190,190.4 191,190.4 191,144.4 192,144.4 192,188.6 193,188.6 193,140 194,140 194,188.4 195,188.4 195,134.4 196,134.4 196,183 197,183 197,125.2 198,125.2 198,183 199,183 199,115.8 200,115.8 200,183 201,183 201,115.8 202,115.8 202,179.4 203,179.4 203,115.8 204,115.8 204,173.8 205,173.8 205,115.8 206,115.8 206,173.8 207,173.8 207,115.8 208,115.8 208,173.6 209,173.6 209,115.8 210,115.8 210,170.4 211,170.4 211,115.8 212,115.8 212,164.8 213,164.8 213,115.8 214,115.8 214,164.8 215,164.8 215,115.8 216,115.8 216,154.2 217,154.2 217,115.8 218,115.8 218,154.2 219,154.2 219,115.8 220,115.8 220,143 221,143 221,115.8 222,115.8 222,143 223,143 223,115.8 224,115.8 224,135.8 225,135.8 225,115.8 234.4,115.8 arc-90 238.4,120 241.6,120 arc-90 245.6,115.8 248.8,115.8 248.8,224.8 248,225.6 247.4,225.6
HEATER  (3 unrouted)
  Top-Supply 0.4: LED1.C 15.78,236.82 14.6,238 12.6,238 12.4,238.2 11.8,238.2 11.6,238 | R1.1 21.2,247 22,246.2 22,245 22.4,244.6 27,244.6 27.2,244.4
  Top-Supply 8: 244.6,227 30.8,227 27,230.8 U$2.P$1 | U$1.P$1 10,229.4 7.4,226.8 4.4,226.8
HEATER-LOW-BOT
  Top-LowHeat 0.762: 3.2,225.8 3.2,113.8 32.4,113.8 arc90 36.4,109.8 37.6,109.8 arc90 41.6,113.8 59,113.8 59,104.4 60,104.4 60,113.8 61,113.8 61,95.2 62,95.2 62,113.8 63,113.8 63,89.6 64,89.6 64,113.8 65,113.8 65,85.2 66,85.2 66,113.8 67,113.8 67,81.2 68,81.2 68,113.8 69,113.8 69,77.8 70,77.8 70,113.8 71,113.8 71,75 72,75 72,113.8 73,113.8 73,72.2 74,72.2 74,113.8 75,113.8 75,69.8 76,69.8 76,113.8 77,113.8 77,67.8 78,67.8 78,113.8 79,113.8 79,65.8 80,65.8 80,113.8 81,113.8 81,63.8 82,63.8 82,113.8 83,113.8 83,62 84,62 84,113.8 85,113.8 85,60.4 86,60.4 86,113.8 87,113.8 87,59 88,59 88,113.8 89,113.8 89,57.6 90,57.6 90,113.8 91,113.8 91,56.4 92,56.4 92,113.8 93,113.8 93,55.2 94,55.2 94,113.8 95,113.8 95,54.2 96,54.2 96,113.8 97,113.8 97,53.2 98,53.2 98,113.8 99,113.8 99,52.2 100,52.2 100,113.8 101,113.8 101,51.4 102,51.4 102,113.8 103,113.8 103,50.6 104,50.6 104,113.8 105,113.8 105,49.8 106,49.8 106,113.8 107,113.8 107,49.2 108,49.2 108,113.8 109,113.8 109,48.6 110,48.6 110,113.8 111,113.8 111,48.2 112,48.2 112,113.8 113,113.8 113,47.6 114,47.6 114,113.8 115,113.8 115,47.2 116,47.2 116,113.8 117,113.8 117,46.8 118,46.8 118,113.8 119,113.8 119,46.6 120,46.6 120,113.8 121,113.8 121,46.4 122,46.4 122,113.8 123,113.8 123,112.2 124,112.2 124,113.8 125,113.8 125,112.2 126,112.2 126,113.8 127,113.8 127,112.2 128,112.2 128,113.8 129,113.8 129,112.2 130,112.2 130,113.8 131,113.8 131,112.2 132,112.2 132,113.8 133,113.8 133,111.2 123,111.2 123,110.2 133,110.2 133,109.2 123,109.2 123,108.2 133,108.2 133,107.2 123,107.2 123,106.2 133,106.2 133,105.2 123,105.2 123,104.2 133,104.2 133,103.2 123,103.2 123,102.2 133,102.2 133,101.2 123,101.2 123,100.2 133,100.2 133,99.2 123,99.2 123,98.2 133,98.2 133,97.2 123,97.2 123,96.2 125.8,96.2 125,95.2 123,95.2 123,94.2 124.8,94.2 124.8,93.2 123,93.2 123,92.2 124.8,92.2 125.2,91.2 123,91.2 123,46.2 124,46.2 124,90.2 125,90.2 125,46 126,46 126,90.6 127,90 127,46 128,46 128,89.8 129,89.8 129,46 130,46 130,90 131,90.6 131,46.2 132,46.2 132,90.2 133,90.2 133,46.2 134,46.2 134,91.2 131.8,91.2 132.2,92.2 134,92.2 134,93.2 132.2,93.2 132.2,94.2 134,94.2 134,95.2 132,95.2 131.4,96.2 134,96.2 134,111.8 135,111.8 135,46.4 136,46.4 136,110.8 137,110 137,46.6 138,46.6 138,109.8 139,109.8 139,46.8 140,46.8 140,109.8 141,110 141,47.2 142,47.2 142,110.8 143,111.8 143,47.6 144,47.6 144,113.8 145,113.8 145,48 146,48 146,113.8 147,113.8 147,48.4 148,48.4 148,113.8 149,113.8 149,49 150,49 150,113.8 151,113.8 151,49.6 152,49.6 152,113.8 153,113.8 153,50.4 154,50.4 154,113.8 155,113.8 155,51.2 156,51.2 156,113.8 157,113.8 157,52 158,52 158,113.8 159,113.8 159,53 160,53 160,113.8 161,113.8 161,54 162,54 162,113.8 163,113.8 163,55.2 164,55.2 164,113.8 165,113.8 165,56.4 166,56.4 166,113.8 167,113.8 167,57.6 168,57.6 168,113.8 169,113.8 169,59 170,59 170,113.8 171,113.8 171,60.4 172,60.4 172,113.8 173,113.8 173,62.2 174,62.2 174,113.8 175,113.8 175,63.8 176,63.8 176,113.8 177,113.8 177,65.6 178,65.6 178,113.8 179,113.8 179,67.8 180,67.8 180,113.8 181,113.8 181,70 182,70 182,113.8 183,113.8 183,72.4 184,72.4 184,113.8 185,113.8 185,75 186,75 186,113.8 187,113.8 187,78 188,78 188,113.8 189,113.8 189,81.4 190,81.4 190,113.8 191,113.8 191,85.2 192,85.2 192,113.8 193,113.8 193,89.6 194,89.6 194,113.8 195,113.8 195,95.2 196,95.2 196,113.8 197,113.8 197,103.6 198,103.6 198,113.8 235.4,113.8 arc90 239.4,109.8 240.6,109.8 arc90 244.6,113.8 250.8,113.8 250.8,225.6 248.8,227.6 247.4,227.6
HEATER-LOW-TOP
  Top-LowHeat 0.762: 4.2,225.8 4.2,114.8 32.4,114.8 arc-90 36.6,119 37.4,119 arc-90 41.6,114.8 59,114.8 59,125 60,125 60,114.8 61,114.8 61,133.4 62,133.4 62,114.8 63,114.8 63,139 64,139 64,114.8 65,114.8 65,143.4 66,143.4 66,114.8 67,114.8 67,147.2 68,147.2 68,114.8 69,114.8 69,150.6 70,150.6 70,114.8 71,114.8 71,153.6 72,153.6 72,114.8 73,114.8 73,156.2 74,156.2 74,114.8 75,114.8 75,158.6 76,158.6 76,114.8 77,114.8 77,160.8 78,160.8 78,114.8 79,114.8 79,163 80,163 80,114.8 81,114.8 81,164.8 82,164.8 82,114.8 83,114.8 83,166.4 84,166.4 84,114.8 85,114.8 85,168.2 86,168.2 86,114.8 87,114.8 87,169.6 88,169.6 88,114.8 89,114.8 89,171 90,171 90,114.8 91,114.8 91,172.2 92,172.2 92,114.8 93,114.8 93,173.4 94,173.4 94,114.8 95,114.8 95,174.6 96,174.6 96,114.8 97,114.8 97,175.6 98,175.6 98,114.8 99,114.8 99,176.6 100,176.6 100,114.8 101,114.8 101,177.4 102,177.4 102,114.8 103,114.8 103,178.2 104,178.2 104,114.8 105,114.8 105,179 106,179 106,114.8 107,114.8 107,179.6 108,179.6 108,114.8 109,114.8 109,180.2 110,180.2 110,114.8 111,114.8 111,180.6 112,180.6 112,114.8 113,114.8 113,181 114,181 114,114.8 115,114.8 115,181.4 116,181.4 116,114.8 117,114.8 117,181.8 118,181.8 118,114.8 119,114.8 119,182 120,182 120,114.8 121,114.8 121,182.2 122,182.2 122,114.8 123,114.8 123,115.8 124,115.8 124,114.8 125,114.8 125,115.8 126,115.8 126,114.8 127,114.8 127,115.8 128,115.8 128,114.8 129,114.8 129,115.8 130,115.8 130,114.8 131,114.8 131,115.8 132,115.8 132,114.8 133,114.8 133,116.8 123,116.8 123,117.8 133,117.8 133,118.8 123,118.8 123,119.8 133,119.8 133,120.8 123,120.8 123,121.8 133,121.8 133,122.8 123,122.8 123,123.8 133,123.8 133,124.8 123,124.8 123,125.8 133,125.8 133,126.8 123,126.8 123,127.8 133,127.8 133,128.8 123,128.8 123,129.8 133,129.8 133,130.8 123,130.8 123,131.8 125.8,131.8 125.2,132.8 123,132.8 123,133.8 124.8,133.8 124.8,134.8 123,134.8 123,135.8 125,135.8 125.2,136.8 123,136.8 123,182.4 124,182.4 124,137.8 125,137.8 125,182.4 126,182.4 126,137.4 127,138 127,182.6 128,182.6 128,138.2 129,138.2 129,182.6 130,182.6 130,138 131,137.4 131,182.6 132,182.6 132,137.8 133,137.8 133,182.4 134,182.4 134,136.8 131.8,136.8 132.2,135.8 134,135.8 134,134.8 132.2,134.8 132.2,133.8 134,133.8 134,132.8 131.8,132.8 131.2,131.8 134,131.8 134,116.8 135,116.8 135,182.2 136,182.2 136,118 137,118.6 137,182 138,182 138,119 139,119 139,181.8 140,181.8 140,119 141,118.6 141,181.4 142,181.4 142,118 143,116.8 143,181 144,181 144,114.8 145,114.8 145,180.4 146,180.4 146,114.8 147,114.8 147,180 148,180 148,114.8 149,114.8 149,179.4 150,179.4 150,114.8 151,114.8 151,178.8 152,178.8 152,114.8 153,114.8 153,178 154,178 154,114.8 155,114.8 155,177.2 156,177.2 156,114.8 157,114.8 157,176.4 158,176.4 158,114.8 159,114.8 159,175.4 160,175.4 160,114.8 161,114.8 161,174.4 162,174.4 162,114.8 163,114.8 163,173.4 164,173.4 164,114.8 165,114.8 165,172.2 166,172.2 166,114.8 167,114.8 167,171 168,171 168,114.8 169,114.8 169,169.6 170,169.6 170,114.8 171,114.8 171,168.2 172,168.2 172,114.8 173,114.8 173,166.6 174,166.6 174,114.8 175,114.8 175,164.8 176,164.8 176,114.8 177,114.8 177,162.8 178,162.8 178,114.8 179,114.8 179,160.8 180,160.8 180,114.8 181,114.8 181,158.8 182,158.8 182,114.8 183,114.8 183,156.4 184,156.4 184,114.8 185,114.8 185,153.6 186,153.6 186,114.8 187,114.8 187,150.8 188,150.8 188,114.8 189,114.8 189,147.4 190,147.4 190,114.8 191,114.8 191,143.4 192,143.4 192,114.8 193,114.8 193,139 194,139 194,114.8 195,114.8 195,133.4 196,133.4 196,114.8 197,114.8 197,124.2 198,124.2 198,114.8 235.4,114.8 arc-90 239.6,119 240.4,119 arc-90 244.6,114.8 249.8,114.8 249.8,225.2 248.4,226.6 247.4,226.6
N$1
  Top-Supply 0.4: R1.2 17.55,245.05 18,244.6 20.2,244.6 21,243.8 21,237.2 20.6,236.8 19.57,236.8 LED1.A
N$3
  pour Bottom: 4,0 0,4 0,231 4,235 4,248.4 5,249.4 32,249.4 33,248.4 33,236 34,235 250,235 254.2,230.8 254.2,4.2 250,0
N$5
  Top-HighHeat 1.16: 1,226 1,112.2 2,111.2
N$6
  Top-HighHeat 1.16: 246.2,229.8 249.8,229.8 253,226.6 | 253,112.2 252.6,111.8
  Top-HighHeat 1.24: 253,226.6 253,112.2
(copper drawn outside any net)
  shapes: Leveling circle x9

### Text on the board
LowHEATArea: 55W
UltraLowHeatArea: 52W
plb: PCB HeatBed MK42 | prusa3d.com | HOT ZONE | DO NOT TOUCH! | HOT ZONE | DO NOT TOUCH! | CAUTION: | Before touching, power off the heatbed and wait at least 10 minutes! | Still hot after powered off! | Do not leave unattended! | Keep away from children! | Designed by: Michal Prusa & Josef Prusa | WARNING: Still hot after LED goes out!
plt: GND | VCC | 12V | HeatBed MK42 by PRUSA3D.COM | 210 | 205 | 155 | 105 | 55 | Print area | [0;0] | 50 | 100 | 150 | 200 | 250
Original: /Volumes/Common/Michal/test3.bmp
201bmp: /Volumes/Common/Michal/test ruka.bmp